# EAGLE design picoAvaR5 (EAGLE 6.1)
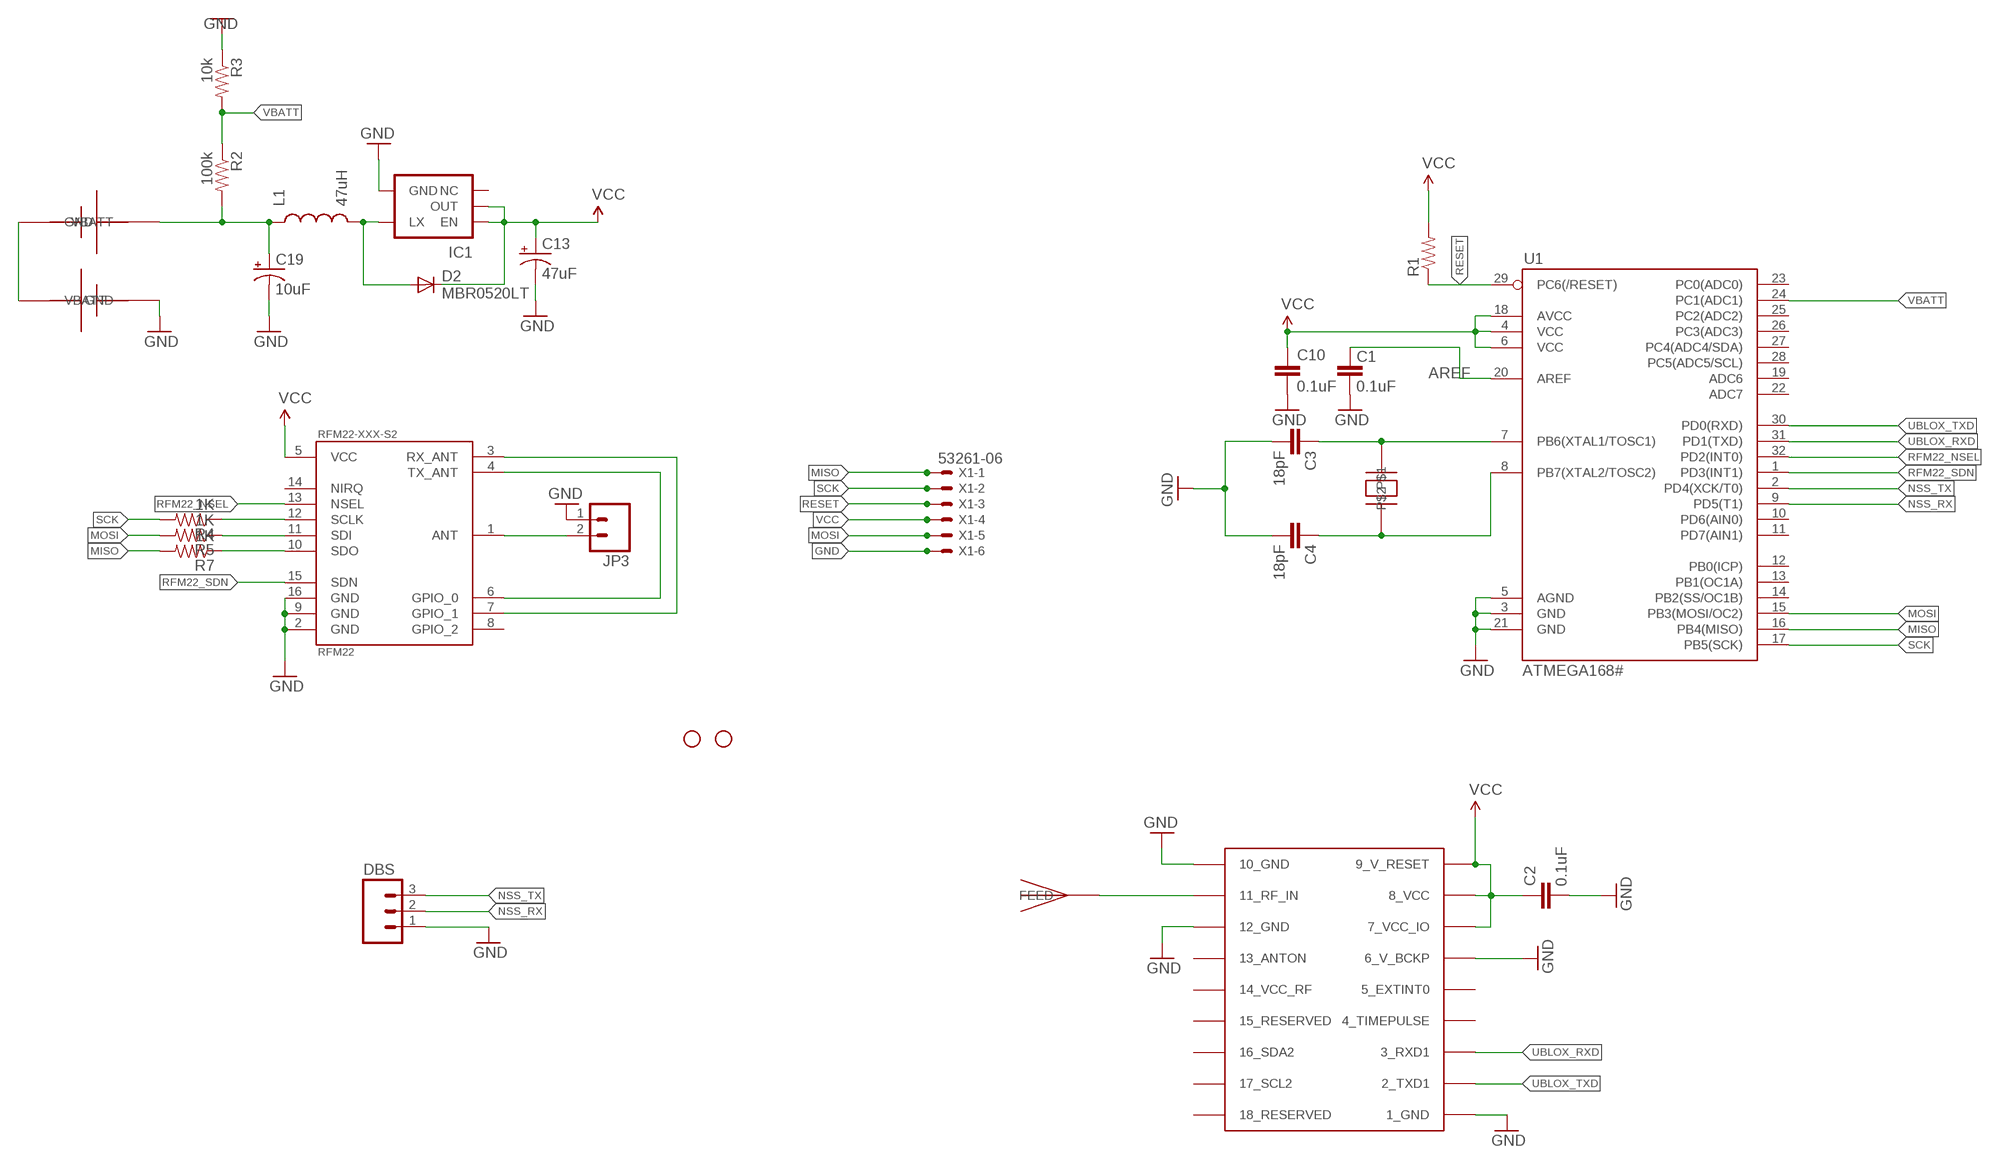
[diagram p0: schematic, sheet 1]

## Parts
C1  0.1uF  CAP0402-CAP  [0402-CAP]
C2  0.1uF  CAP0402-CAP  [0402-CAP]
C3  18pF  CAP0402-CAP  [0402-CAP]
C4  18pF  CAP0402-CAP  [0402-CAP]
C10  0.1uF  CAP0402-CAP  [0402-CAP]
C13  47uF  CAP_POL1206  [EIA3216]
C19  10uF  CAP_POL1206  [EIA3216]
D2  MBR0520LT  [SOD123]
DBS  M03PTH  [1X03]
IC1  V_REG_NCP1400SOT23-5  [SOT23-5]
JP1  STAND-OFF  [STAND-OFF]
JP2  STAND-OFF  [STAND-OFF]
JP3  M02PTH  [1X02]
L1  47uH  INDUCTOR1210  [1210]
R1  RESISTOR0402-RES  [0402-RES]
R2  100k  RESISTOR0402-RES  [0402-RES]
R3  10k  RESISTOR0402-RES  [0402-RES]
R4  1K  RESISTOR0402-RES  [0402-RES]
R5  1K  RESISTOR0402-RES  [0402-RES]
R7  1K  RESISTOR0402-RES  [0402-RES]
RFM22-XXX-S2  RFM22  [RFM22-XXX-S2]
U1  ATMEGA168#  ATMEGA168  [TQFP32-08]
U$1  UBLOX_MAX-6  [UBLOX_MAX-6]
U$2  ABRACON_ABM3_CRYSTAL  [ABRACON_ABM3_CRYSTAL]
U$3  JTI_ANTENNA-1575AT43A40  [JTI_ANTENNA-1575AT43A40]
U$4  KEYSTONE-82-AAA-BATTERY-HOLDER  [KEYSTONE-82-AAA-BATTERY]
U$5  KEYSTONE-82-AAA-BATTERY-HOLDER  [KEYSTONE-82-AAA-BATTERY]
X1  53261-06  [53261-06]

## Nets
AREF: C1.2 U1.20(AREF)
BATTERY [vcc]: C19.A(+) L1.1 R2.2 U$4.VBATT U$4.VBATT1(VBATT)
GND [vcc]: C1.1 C2.2 C3.2 C4.2 C10.2 C13.C(-) C19.C(-) DBS.1 IC1.4(GND) JP3.1 R3.1 RFM22-XXX-S2.2(GND) RFM22-XXX-S2.9(GND) RFM22-XXX-S2.16(GND) U1.3(GND) U1.5(AGND) U1.21(GND) U$1.1_GND U$1.6_V_BCKP U$1.10_GND U$1.12_GND U$5.GND U$5.GND2(GND) X1.6
MISO: R7.2 U1.16(PB4(MISO)) X1.1
MOSI: R5.2 U1.15(PB3(MOSI/OC2)) X1.5
N$1: U$4.GND U$4.GND2(GND) U$5.VBATT U$5.VBATT1(VBATT)
N$2: R4.1 RFM22-XXX-S2.12(SCLK)
N$3: JP3.2 RFM22-XXX-S2.1(ANT)
N$4: U$1.11_RF_IN U$3.FEED
N$5: RFM22-XXX-S2.3(RX_ANT) RFM22-XXX-S2.7(GPIO_1)
N$6: RFM22-XXX-S2.4(TX_ANT) RFM22-XXX-S2.6(GPIO_0)
N$7: R5.1 RFM22-XXX-S2.11(SDI)
N$9: C3.1 U1.7(PB6(XTAL1/TOSC1)) U$2.P$2
N$10: C4.1 U1.8(PB7(XTAL2/TOSC2)) U$2.P$1
N$11: D2.A IC1.5(LX) L1.2
N$12: R7.1 RFM22-XXX-S2.10(SDO)
NSS_RX: DBS.2 U1.9(PD5(T1))
NSS_TX: DBS.3 U1.2(PD4(XCK/T0))
RESET: R1.1 U1.29(PC6(/RESET)) X1.3
RFM22_NSEL: RFM22-XXX-S2.13(NSEL) U1.32(PD2(INT0))
RFM22_SDN: RFM22-XXX-S2.15(SDN) U1.1(PD3(INT1))
SCK: R4.2 U1.17(PB5(SCK)) X1.2
UBLOX_RXD: U1.31(PD1(TXD)) U$1.3_RXD1
UBLOX_TXD: U1.30(PD0(RXD)) U$1.2_TXD1
VBATT [vcc]: R2.1 R3.2 U1.24(PC1(ADC1))
VCC: C2.1 C10.1 C13.A(+) D2.C IC1.1(EN) IC1.2(OUT) R1.2 RFM22-XXX-S2.5(VCC) U1.4(VCC) U1.6(VCC) U1.18(AVCC) U$1.7_VCC_IO U$1.8_VCC U$1.9_V_RESET X1.4
Unconnected: IC1.3(NC) RFM22-XXX-S2.8(GPIO_2) RFM22-XXX-S2.14(NIRQ) U1.10(PD6(AIN0)) U1.11(PD7(AIN1)) U1.12(PB0(ICP)) U1.13(PB1(OC1A)) U1.14(PB2(SS/OC1B)) U1.19(ADC6) U1.22(ADC7) U1.23(PC0(ADC0)) U1.25(PC2(ADC2)) U1.26(PC3(ADC3)) U1.27(PC4(ADC4/SDA)) U1.28(PC5(ADC5/SCL)) U$1.4_TIMEPULSE U$1.5_EXTINT0 U$1.13_ANTON U$1.14_VCC_RF U$1.15_RESERVED U$1.16_SDA2 U$1.17_SCL2 U$1.18_RESERVED

## Library data of the parts
C1-C4 C10 = SparkFun:CAP: Capacitor Standard 0603 ceramic capacitor, and 0.1" leaded capacitor.
C13 C19 = SparkFun:CAP_POL: Capacitor Polarized These are standard SMD and PTH capacitors. Normally 10uF, 47uF, and 100uF in electrolytic and tantalum varieties. Always verify the external diameter of the through hole cap, it varies with capacity, voltage, and manufacturer. The EIA devices should be standard.
D2 = diode:MBR0520LT: SCHOTTKY BARRIER RECTIFIER Source: http://onsemi.com .. MBR0520LT1-D.pdf
DBS = SparkFun:M03: Header 3 Standard 3-pin 0.1" header. Use with straight break away headers (SKU : PRT-00116), right angle break away headers (PRT-00553), swiss pins (PRT-00743), machine pins (PRT-00117), and female headers (PRT-00115). Molex polarized connector foot print use with SKU : PRT-08232 with associated crimp pins and housings.
IC1 = SparkFun:V_REG_NCP1400: Switching step-up voltage regulator NCP1400 switiching regulator takes single cell AA and outputs 100mA at 3.3V or 5V with minimal number of external components.
JP1 JP2 = SparkFun:STAND-OFF: Stand Off This is the mechanical footprint for a #4 phillips button head screw. Use the keepout ring to avoid running the screw head into surrounding components. SKU : PRT-00447
JP3 = SparkFun:M02: Header 2 Standard 2-pin 0.1" header. Use with straight break away headers (SKU : PRT-00116), right angle break away headers (PRT-00553), swiss pins (PRT-00743), machine pins (PRT-00117), and female headers (PRT-00115). Molex polarized connector foot print use with SKU : PRT-08233 with associated crimp pins and housings.
L1 = SparkFun:INDUCTOR: Inductors Basic Inductor/Choke - 0603 and 1206. Footprints are not proven and vary greatly between part numbers.
R1-R5 R7 = SparkFun:RESISTOR: Resistor Basic schematic elements and footprints for 0603, 1206, and PTH resistors.
RFM22-XXX-S2 = SparkFun:RFM22: *Hope RF's RFM22* Packages: RFM22-S2 (SMD)
U1 = SparkFun:ATMEGA168
U$1 = ava:UBLOX_MAX-6: UBLOX MAX-6
U$2 = ava:ABRACON_ABM3_CRYSTAL
U$3 = ava:JTI_ANTENNA-1575AT43A40
U$4 U$5 = ava:KEYSTONE-82-AAA-BATTERY-HOLDER
X1 = con-molex:53?-06: CONNECTOR wire to board 1.25 mm (.049 inch) pitch header; OC_FARNELL: 1125375; OC_NEWARK: unknown

## Net classes
0 default: width 0.203 mm
1 vcc: width 0.254 mm

## Board
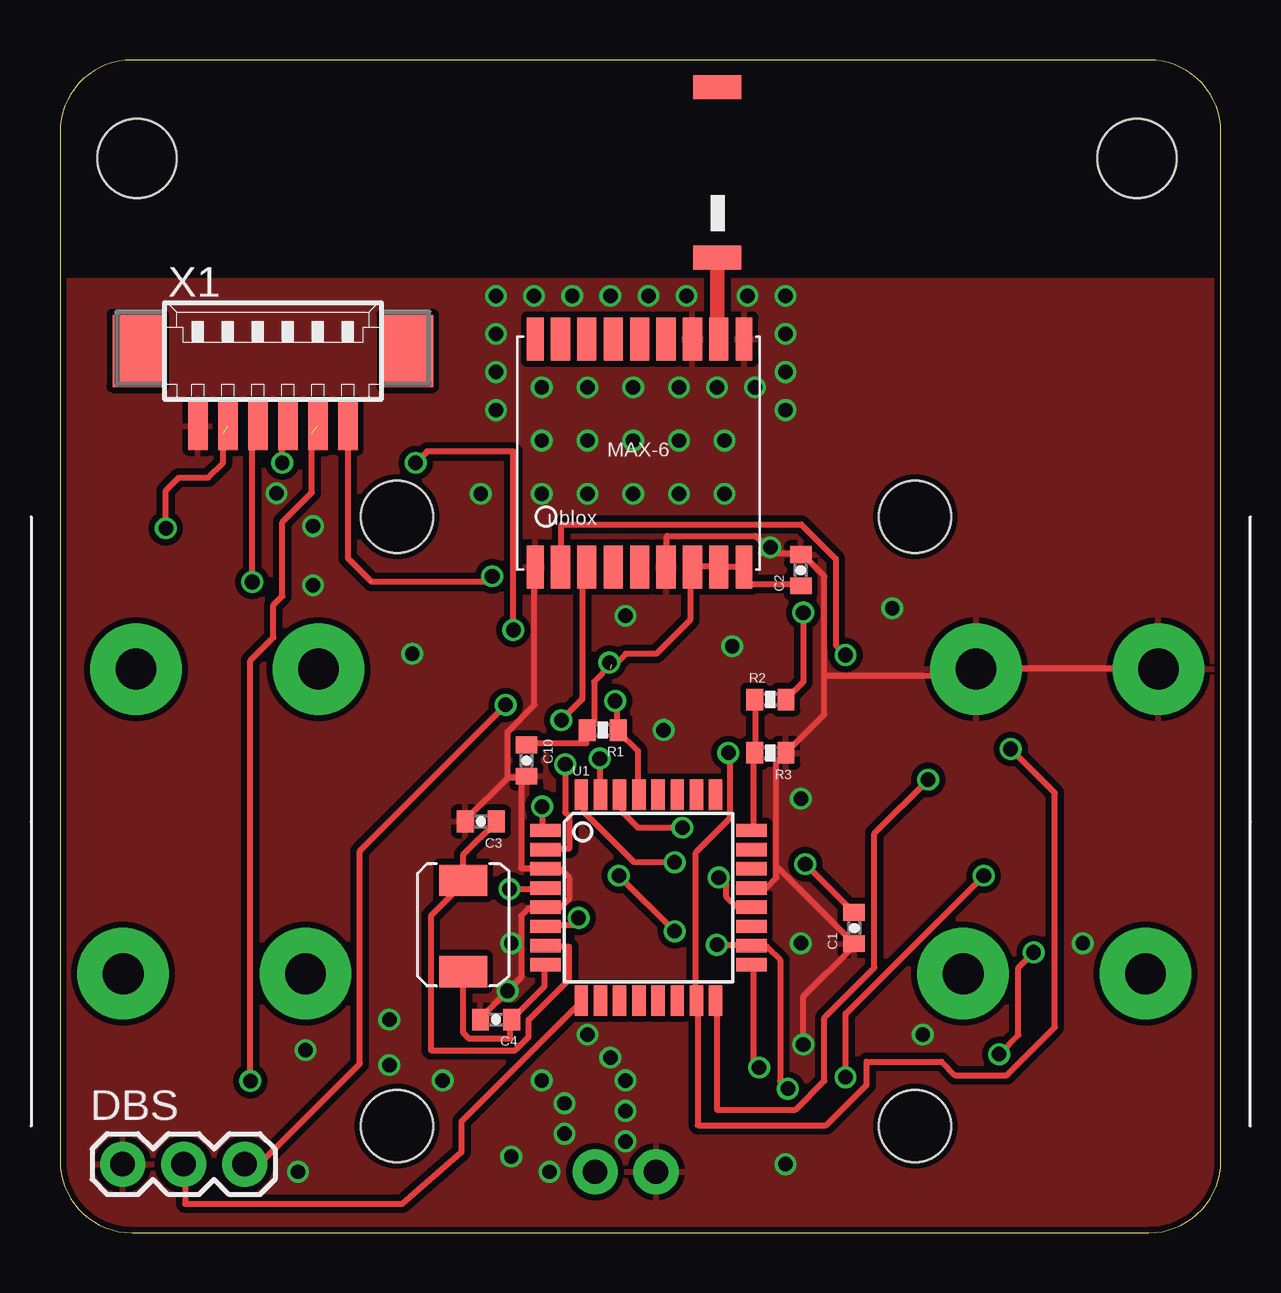
[diagram p1: board, top side]
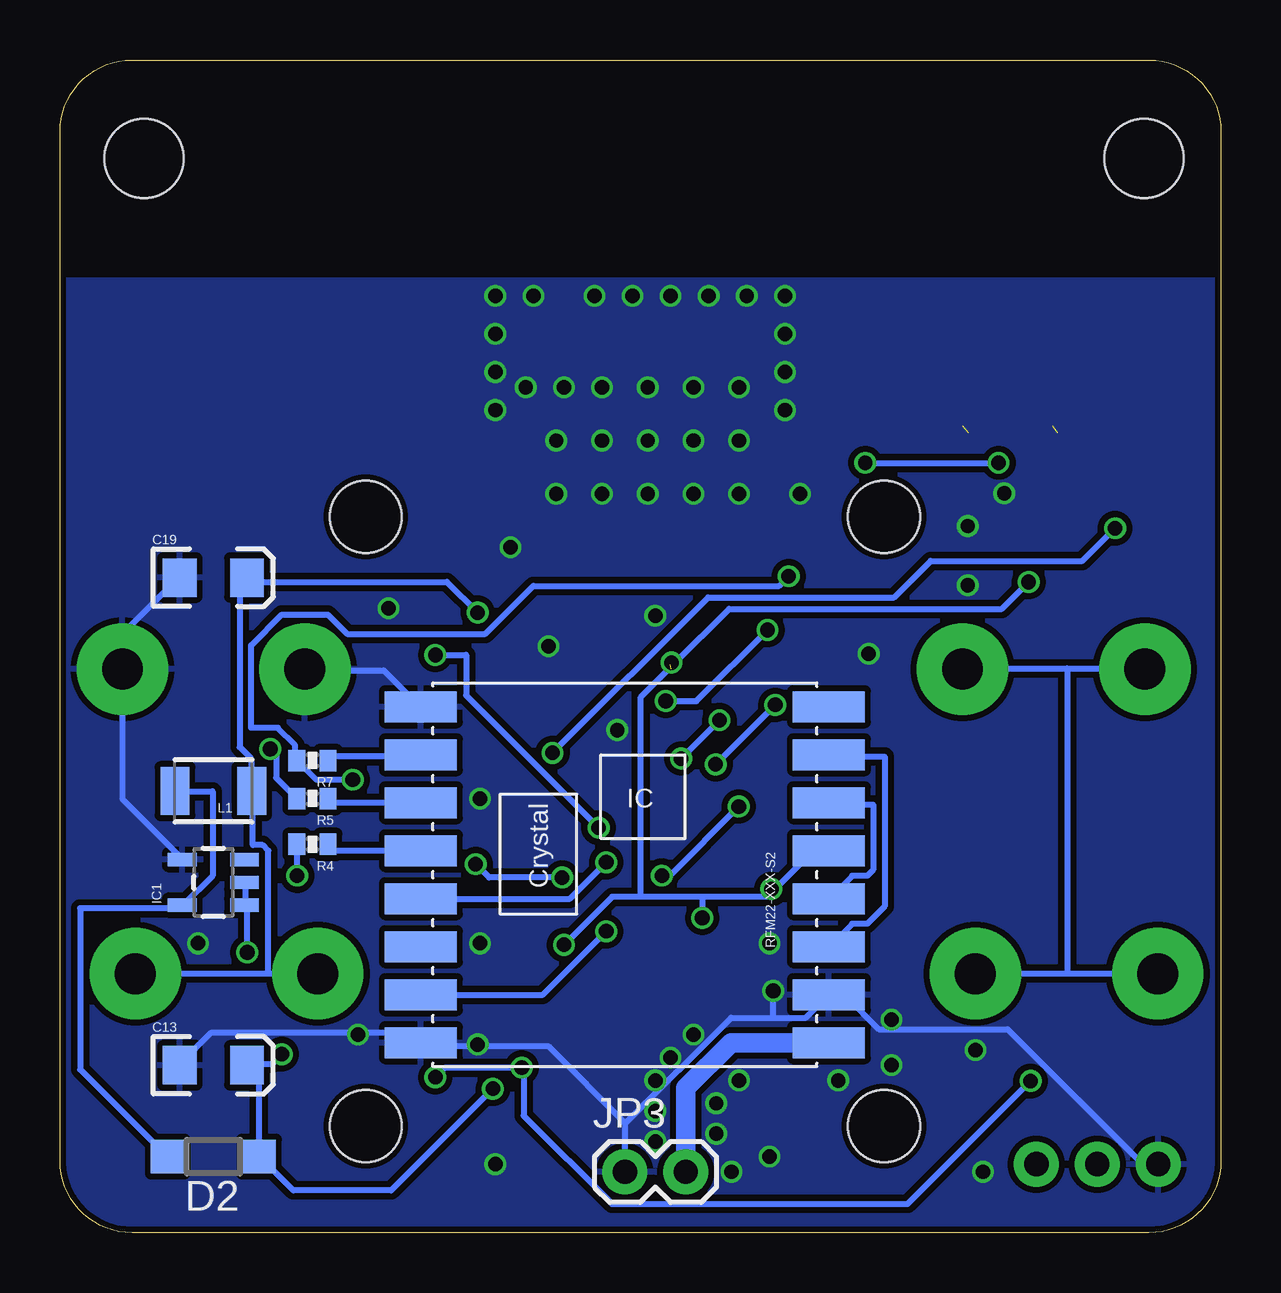
[diagram p2: board, bottom side, seen from below]

Size 48.37 x 48.89 mm. Coordinates in mm from the lower left corner, seen from the top.
Outline: 0,45.89 0,3 arc90 3,0 45.37,0 arc90 48.37,3 48.37,45.89 arc90 45.37,48.89 3,48.89 arc90 0,45.89
Copper layers (1*16): Top 0.035mm / dielectric 1.5mm / Bottom 0.035mm
Design rules: minimum track width 6mil, minimum drill 12mil, track to track 6mil, track to pad 6mil, pad to pad 6mil, via to via 6mil, smd to smd 0mil, copper to edge 10mil, drill to drill 10mil, minimum pad ring 10mil, minimum via ring 6mil, stop-mask expansion 2mil, vias tented up to drill 100mil, thermal gap 10mil
Holes 3 mm at 35.63,29.84 35.63,4.45 14.04,4.45 14.04,29.84

### Footprints (pad centres in the part's own frame; a part is rotated, then mirrored left to right if it is on the bottom)
0402-CAP = smd 0.7 x 0.9: 1 -0.65,0; 2 0.65,0
EIA3216 = smd 1.4 x 1.6: A 1.4,0; C -1.4,0
SOD123 = smd 1.4 x 1.4: A 1.9,0; C -1.9,0
1X03 = drill 1.016 pad 1.88: 1 0,0; 2 2.54,0; 3 5.08,0
SOT23-5 = smd 0.55 x 1.2: 1 -0.95,-1.3; 2 0,-1.3; 3 0.95,-1.3; 4 0.95,1.3; 5 -0.95,1.3
STAND-OFF = hole 3.302: 0,0
1X02 = drill 1.016 pad 1.88: 1 0,0; 2 2.54,0
1210 = smd 1.2 x 2: 1 -1.6,0; 2 1.6,0
0402-RES = smd 0.7 x 0.9: 1 -0.65,0; 2 0.65,0
RFM22-XXX-S2 = smd 3 x 1.3: 1 -8.5,7; 2 -8.5,5; 3 -8.5,3; 4 -8.5,1; 5 -8.5,-1; 6 -8.5,-3; 7 -8.5,-5; 8 -8.5,-7; 9 8.5,-7; 10 8.5,-5; 11 8.5,-3; 12 8.5,-1; 13 8.5,1; 14 8.5,3; 15 8.5,5; 16 8.5,7
TQFP32-08 = smd 1.27 x 0.559: 1 -4.293,2.8; 2 -4.293,2; 3 -4.293,1.2; 4 -4.293,0.4; 5 -4.293,-0.4; 6 -4.293,-1.2; 7 -4.293,-2; 8 -4.293,-2.8; 17 4.293,-2.8; 18 4.293,-2; 19 4.293,-1.2; 20 4.293,-0.4; 21 4.293,0.4; 22 4.293,1.2; 23 4.293,2; 24 4.293,2.8 | smd 0.559 x 1.27: 9 -2.8,-4.293; 10 -2,-4.293; 11 -1.2,-4.293; 12 -0.4,-4.293; 13 0.4,-4.293; 14 1.2,-4.293; 15 2,-4.293; 16 2.8,-4.293; 25 2.8,4.293; 26 2,4.293; 27 1.2,4.293; 28 0.4,4.293; 29 -0.4,4.293; 30 -1.2,4.293; 31 -2,4.293; 32 -2.8,4.293
UBLOX_MAX-6 = smd 1.8 x 0.7: 1_GND 4.95,-4.4; 9_V_RESET 4.95,4.3; 10_GND -4.55,4.3; 18_RESERVED -4.55,-4.4 | smd 1.8 x 0.8: 2_TXD1 4.95,-3.35; 3_RXD1 4.95,-2.25; 4_TIMEPULSE 4.95,-1.15; 5_EXTINT0 4.95,-0.05; 6_V_BCKP 4.95,1.05; 7_VCC_IO 4.95,2.15; 8_VCC 4.95,3.25; 11_RF_IN -4.55,3.25; 12_GND -4.55,2.15; 13_ANTON -4.55,1.05; 14_VCC_RF -4.55,-0.05; 15_RESERVED -4.55,-1.15; 16_SDA2 -4.55,-2.25; 17_SCL2 -4.55,-3.35
ABRACON_ABM3_CRYSTAL = smd 1.3 x 2: P$1 -3.4,0.1; P$2 0.4,0.1
JTI_ANTENNA-1575AT43A40 = smd 1 x 2: FEED -3.81,-1.27; NC 3.29,-1.27
KEYSTONE-82-AAA-BATTERY = drill 1.7 pad 3.81: GND -21.57,0; GND2 -13.97,0; VBATT 13.43,0; VBATT1 21.03,0
53261-06 = smd 0.8 x 2: 1 3.125,-2.5; 2 1.875,-2.5; 3 0.625,-2.5; 4 -0.625,-2.5; 5 -1.875,-2.5; 6 -3.125,-2.5 | smd 2.1 x 3: S1 5.625,0.625; S2 -5.625,0.625

### Placement (x,y rotation side)
C1  33.09,12.7 90 top
C2  30.87,27.62 90 top
C3  17.53,17.14 180 top
C4  18.17,8.89 180 top
C10  19.44,19.68 270 top
C13  41.98,6.99 0 bottom
C19  41.98,27.3 0 bottom
D2  41.98,3.17 180 bottom
DBS  2.61,2.86 0 top
IC1  41.98,14.61 90 bottom
JP1  3.21,44.79 0 top
JP2  44.87,44.79 0 top
JP3  24.84,2.54 0 bottom
L1  41.98,18.41 180 bottom
R1  22.61,20.95 180 top
R2  29.6,22.22 0 top
R3  29.6,20 180 top
R4  37.85,16.19 180 bottom
R5  37.85,18.1 180 bottom
R7  37.85,19.68 180 bottom
RFM22-XXX-S2  24.84,14.92 180 bottom
U1  24.52,13.97 0 top
U$1  24.2,32.7 270 top
U$2  16.9,14.29 90 top
U$3  26.11,44.45 90 top
U$4  24.2,10.79 0 top
U$5  24.2,23.49 180 top
X1  8.87,36.12 0 top

### Tracks (layer width: path | path; a pad name or v marks a point on that pad's centre or on a via)
AREF  (via drill 0.61)
  Top 0.254: v31.05,15.37 33.05,13.37 C1.2 | v27.45,14.8 27.77,14.48 27.77,14.01 28.17,13.61 28.81,13.61 U1.20
  Bottom 0.254: v31.05,15.37 30.49,14.8 v27.45,14.8
BATTERY  (via drill 0.61)
  Top 0.254: v30.97,25.84 30.97,22.96 30.25,22.24 R2.2
  Bottom 0.254: v30.97,25.84 32.25,27.12 40.41,27.12 40.57,27.29 C19.A 40.49,27.04 40.89,27.04 40.89,20.24 40.41,19.76 40.41,18.48 L1.1 40.33,18.32 40.33,16.16 39.93,16.16 39.69,15.92 39.69,10.8 | 39.69,10.8 45.21,10.8 U$4.VBATT1 | 39.69,10.8 37.69,10.8 U$4.VBATT
GND  (via drill 0.6, 0.61)
  Top 0.254: U$1.6_V_BCKP 25.29,27.76 25.29,29.04 28.97,29.04 29.21,28.8 29.21,28.32 30.81,28.32 C2.2 30.97,28.24 31.85,27.36 31.85,23.2 | 29.85,15.21 29.85,14.8 29.45,14.4 28.89,14.4 U1.21 | 29.85,15.21 29.85,19.6 R3.1 31.85,21.6 31.85,23.2 | 29.85,15.21 29.93,15.21 33.05,12.09 C1.1 33.05,11.93 30.97,9.85 v30.97,7.85 | U$5.GND 45.77,23.52 38.17,23.52 U$5.GND2 38.09,23.44 38.09,23.2 31.85,23.2 | C4.2 17.53,8.96 v18.65,10.09 19.21,10.64 19.21,13.21 19.53,13.53 20.17,13.53 U1.5 20.33,13.61 20.89,13.61 21.21,13.93 21.21,14.8 20.89,15.12 20.33,15.12 U1.3 20.17,15.21 19.21,15.21 19.21,18.88 C10.2 19.37,18.96 18.65,18.96 | 18.65,18.96 16.89,17.2 C3.2 | 18.65,18.96 18.65,20.88 19.77,22 19.77,27.68 U$1.1_GND
  Bottom 0.254: RFM22-XXX-S2.9 33.37,21.92 34.89,23.44 38.17,23.44 U$5.GND2 | IC1.4 43.29,15.6 45.77,18.08 U$5.GND 45.77,24.96 43.45,27.29 C19.C | C13.C 43.37,7.04 42.09,8.33 33.77,8.33 33.37,7.93 RFM22-XXX-S2.16 33.21,7.93 33.05,7.77 30.97,7.77 | 18.65,8.96 20.41,8.96 24.81,4.57 | 18.65,8.96 17.29,8.96 16.41,9.85 RFM22-XXX-S2.2 16.25,9.85 15.61,9.85 14.25,8.48 8.89,8.48 2.65,2.25 DBS.1 | 24.81,4.57 24.81,2.57 JP3.1 | 30.97,7.77 28.01,7.77 24.81,4.57 | 18.65,8.96 v18.65,10.09 | v30.97,7.85 30.97,7.77
  other vias: 23.57,25.72 25.15,20.95 34.68,26.04 30.87,18.1 30.87,12.06 35.95,8.26 17.53,30.8 9.91,2.54 18.8,3.17 13.72,8.89 42.62,12.06 29.6,28.57 20.07,35.24 21.98,35.24 23.88,35.24 25.79,35.24 27.38,35.24 20.07,30.8 20.07,33.02 21.98,30.8 21.98,33.02 23.88,33.02 23.88,30.8 25.79,33.02 25.79,30.8 27.69,33.02 27.69,30.8 28.64,39.05 26.11,39.05 18.17,35.88 24.52,39.05 22.93,39.05 21.34,39.05 19.76,39.05 18.17,39.05 18.17,37.47 18.17,34.29 30.23,39.05 30.23,37.47 30.23,35.88 30.23,34.29 23.57,6.35 22.93,7.3 23.57,5.08 23.57,3.81 21.03,5.4 20.39,2.54 20.07,6.35 21.98,8.26 21.03,4.13 15.94,6.35 13.72,6.99 18.8,12.06 30.23,2.86 28.96,35.24 10.23,7.62 28.01,24.45 14.67,24.13 10.55,26.99 9.03,30.83 10.55,29.46
  pour Top (isolate 0.254): -2.47,39.69 50.23,39.69 50.23,-0.64 -2.47,-0.64
  pour Bottom (isolate 0.254): -2.47,39.69 50.23,39.69 50.23,-0.64 -2.47,-0.64
MISO  (via drill 0.61)  (1 unrouted)
  Top 0.254: v36.17,18.88 33.93,16.64 33.93,11.04 31.85,8.96 31.85,6.33 30.65,5.12 27.37,5.12 27.37,9.61 U1.16 | 12.97,27.12 18.01,27.12 v18.01,27.36 | X1.1 12,28.12 12.97,27.15
  Bottom 0.254: v36.17,18.88 37.69,18.88 R7.2 38.57,19.76 38.57,20.32 39.29,21.04 40.41,21.04 40.41,24.48 39.13,25.76 37.21,25.76 36.41,24.96 30.65,24.96 28.65,26.96 18.41,26.96 v18.01,27.36
MOSI  (via drill 0.61)  (1 unrouted)
  Top 0.254: v39.61,20.16 41.45,18.32 41.45,8.56 39.45,6.57 37.29,6.57 36.73,7.12 33.61,7.12 33.61,6.17 31.93,4.49 26.57,4.49 26.57,9.61 U1.15 26.49,9.77 26.49,15.85 27.93,17.29 27.93,19.92 v27.85,20 | v4.41,29.36 4.41,30.94 4.94,31.47 6.17,31.47 6.79,32.09 6.79,33.33
  Bottom 0.254: R5.2 39.37,18.96 39.37,20.16 v39.61,20.16 | v4.41,29.36 5.77,28 12.09,28 13.61,26.48 21.37,26.48 v27.85,20
N$1
  Bottom 0.254: 6.41,10.8 10.17,10.8 U$4.GND2 | 6.41,10.8 2.65,10.8 U$4.GND | 6.41,23.52 10.73,23.52 U$5.VBATT | 6.41,23.52 3.21,23.52 U$5.VBATT1 | 6.41,23.52 6.41,10.8
N$2
  Bottom 0.254: R4.1 37.13,16.16 36.89,15.92 33.37,15.92 RFM22-XXX-S2.12
N$3
  Bottom 0.813: RFM22-XXX-S2.1 20.41,7.92 22.3,6.03 JP3.2
N$4
  Top 0.254: 27.38,37.15 27.38,37.18 U$1.11_RF_IN
  Top 0.61: U$3.FEED 27.38,37.15
N$5
  Bottom 0.254: RFM22-XXX-S2.3 15.37,12.88 14.73,12.88 14.01,13.61 14.01,19.84 16.33,19.84 RFM22-XXX-S2.7
N$6
  Bottom 0.254: RFM22-XXX-S2.4 15.37,14.88 14.73,14.88 14.49,15.12 14.49,17.84 16.33,17.84 RFM22-XXX-S2.6
N$7
  Bottom 0.254: R5.1 37.13,18.08 36.97,17.92 33.37,17.92 RFM22-XXX-S2.11
N$9
  Top 0.254: C3.1 18.17,17.12 16.81,15.76 16.81,14.72 U$2.P$2 16.81,14.56 15.45,13.21 15.45,7.61 18.97,7.61 19.53,8.17 19.53,8.88 21.21,10.56 21.21,11.93 20.25,11.93 U1.7
N$10
  Top 0.254: U1.8 20.17,11.12 20.17,10.25 18.89,8.96 C4.1 18.73,8.8 18.73,8.09 17.05,8.09 16.81,8.33 U$2.P$1
N$11
  Bottom 0.254: L1.2 43.53,18.4 42.01,18.4 42.01,14.88 43.21,13.69 IC1.5 43.29,13.53 47.53,13.53 47.53,6.81 43.93,3.21 D2.A
N$12
  Bottom 0.254: R7.1 37.13,19.68 36.97,19.84 33.37,19.84 RFM22-XXX-S2.10
NSS_RX
  Top 0.254: U1.9 21.69,9.61 16.73,4.65 16.73,3.37 14.25,1.2 5.21,1.2 5.21,2.17 DBS.2
NSS_TX  (via drill 0.61)
  Top 0.254: v21.05,19.52 21.05,17.52 21.21,17.36 21.21,16 20.25,16 U1.2 | v18.57,22 12.49,15.92 12.49,7.04 7.69,2.25 DBS.3
  Bottom 0.254: v18.57,22 v21.05,19.52
RESET  (via drill 0.6, 0.61)
  Top 0.254: U1.29 24.09,18.32 24.09,20.08 23.29,20.88 R1.1 23.21,21.04 23.21,22.08 v23.13,22.16 | v18.89,25.12 18.89,32.57 15.29,32.57 v14.82,32.09 | v9.26,32.09 9.26,33.39 X1.3
  Bottom 0.254: v18.89,25.12 21.85,22.16 v23.13,22.16 | v14.82,32.09 v9.26,32.09
RFM22_NSEL  (via drill 0.61)
  Top 0.254: v25.61,15.44 23.93,15.44 21.85,17.52 21.85,18.16 21.77,18.24 U1.32
  Bottom 0.254: v25.61,15.44 27.13,13.93 33.29,13.93 RFM22-XXX-S2.13
RFM22_SDN  (via drill 0.61)
  Top 0.254: v20.09,17.76 20.09,16.88 20.17,16.8 U1.1 | v25.61,12.56 v23.29,14.88
  Bottom 0.254: v20.09,17.76 22.97,14.88 v23.29,14.88 | v25.61,12.56 28.25,9.93 33.29,9.93 RFM22-XXX-S2.15
SCK  (via drill 0.61)  (1 unrouted)
  Top 0.254: v38.49,14.88 32.73,9.12 v32.73,6.49 | v29.13,6.88 28.89,7.12 28.89,11.12 U1.17 | v7.93,6.33 7.93,23.84 8.89,24.8 8.89,26.16 9.26,26.54 9.26,29.62 10.5,30.86 10.5,33.33
  Bottom 0.254: v38.49,14.88 38.49,16.16 R4.2 | v32.73,6.49 32.33,6.88 v29.13,6.88 29.05,6.81 29.05,4.88 25.37,1.21 13.05,1.21 v7.93,6.33
UBLOX_RXD  (via drill 0.61)
  Top 0.254: v22.49,19.76 22.49,18.32 U1.31 | v20.89,21.36 21.77,22.24 21.77,27.52 21.93,27.68 U$1.3_RXD1
  Bottom 0.254: v20.89,21.36 v22.49,19.76
UBLOX_TXD  (via drill 0.61)
  Top 0.254: v25.93,16.88 24.09,16.88 23.45,17.52 23.45,18.16 23.37,18.24 U1.30 | v32.73,24.08 32.33,24.48 32.33,28.08 30.89,29.52 20.89,29.52 20.89,27.76 U$1.2_TXD1
  Bottom 0.254: v25.93,16.88 31.45,22.4 31.45,24.08 v32.73,24.08
VBATT
  Top 0.254: R2.1 28.97,22.16 28.97,20 R3.2 28.89,19.92 28.89,16.8 U1.24
VCC  (via drill 0.61)  (1 unrouted)
  Top 0.254: C2.1 30.81,27.04 28.57,27.04 28.57,27.68 U$1.9_V_RESET 28.41,27.76 27.53,27.76 U$1.8_VCC 26.41,27.76 U$1.7_VCC_IO 26.25,27.68 26.25,25.54 24.84,24.13 23.57,24.13 22.93,23.49 | C10.1 19.45,20.4 21.93,20.4 21.93,20.88 R1.2 22.01,21.04 22.25,21.29 22.25,22.96 22.97,23.68 v22.89,23.76 | v40.57,11.69 39.93,11.04 39.93,8.25 v39.13,7.45 | v27.37,12.01 28.81,12.01 U1.18 28.89,11.93 29.45,11.93 30.01,11.37 30.01,6.33 v30.33,6 | v21.61,13.12 21.61,12.8 20.25,12.8 U1.6 | v18.73,14.33 20.17,14.33 U1.4 | v8.01,27.12 8.01,33.39 X1.4
  Bottom 0.254: IC1.2 40.65,14.56 40.65,13.69 IC1.1 40.57,13.61 v40.57,11.69 | v39.13,7.45 39.53,7.04 40.01,7.04 C13.A 40.57,6.96 40.09,6.96 40.09,3.21 D2.C 40.01,3.12 38.65,1.76 34.57,1.76 v30.33,6 | v27.37,12.01 25.37,14.01 24.17,14.01 | 21.61,14.01 18.89,14.01 18.65,14.25 | 21.61,14.01 24.17,14.01 | 18.65,14.25 17.05,15.85 16.41,15.85 RFM22-XXX-S2.5 | 21.61,14.01 v21.61,13.12 | v18.73,14.33 18.65,14.25 | v8.01,27.12 9.13,26 20.49,26 22.81,23.68 | 22.81,23.68 24.17,22.32 24.17,14.01 | v22.89,23.76 22.81,23.68